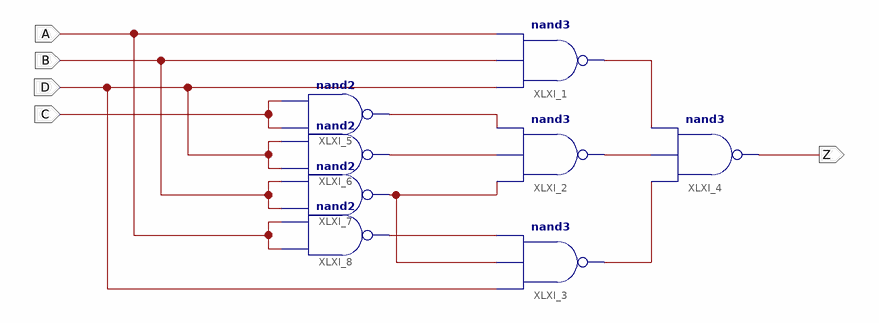
[diagram p0: schematic sheet 1]
// Xilinx ISE schematic p1ej1b.sch (spartan3) as structural Verilog: 8 symbols, 5 ports
module p1ej1b (
  input  C,
  input  A,
  input  B,
  input  D,
  output Z
);

  wire XLXN_6, XLXN_20, XLXN_21, XLXN_22, XLXN_23, XLXN_38, XLXN_39;

  nand XLXI_1 (XLXN_22, D, B, A);
  nand XLXI_2 (XLXN_21, XLXN_39, XLXN_38, XLXN_6);
  nand XLXI_3 (XLXN_23, D, XLXN_39, XLXN_20);
  nand XLXI_4 (Z, XLXN_23, XLXN_21, XLXN_22);
  nand XLXI_5 (XLXN_6, C, C);
  nand XLXI_6 (XLXN_38, D, D);
  nand XLXI_7 (XLXN_39, B, B);
  nand XLXI_8 (XLXN_20, A, A);
endmodule
